# EasyEDA Pro project Drone system.epro

# Schematic Schematic1_1
Board Name: Board1; Create Date: 2025-09-21; Page Name: P1; Project Name: Gy10_201; Schematic Name: Schematic1_1; Update Date: 2025-09-21
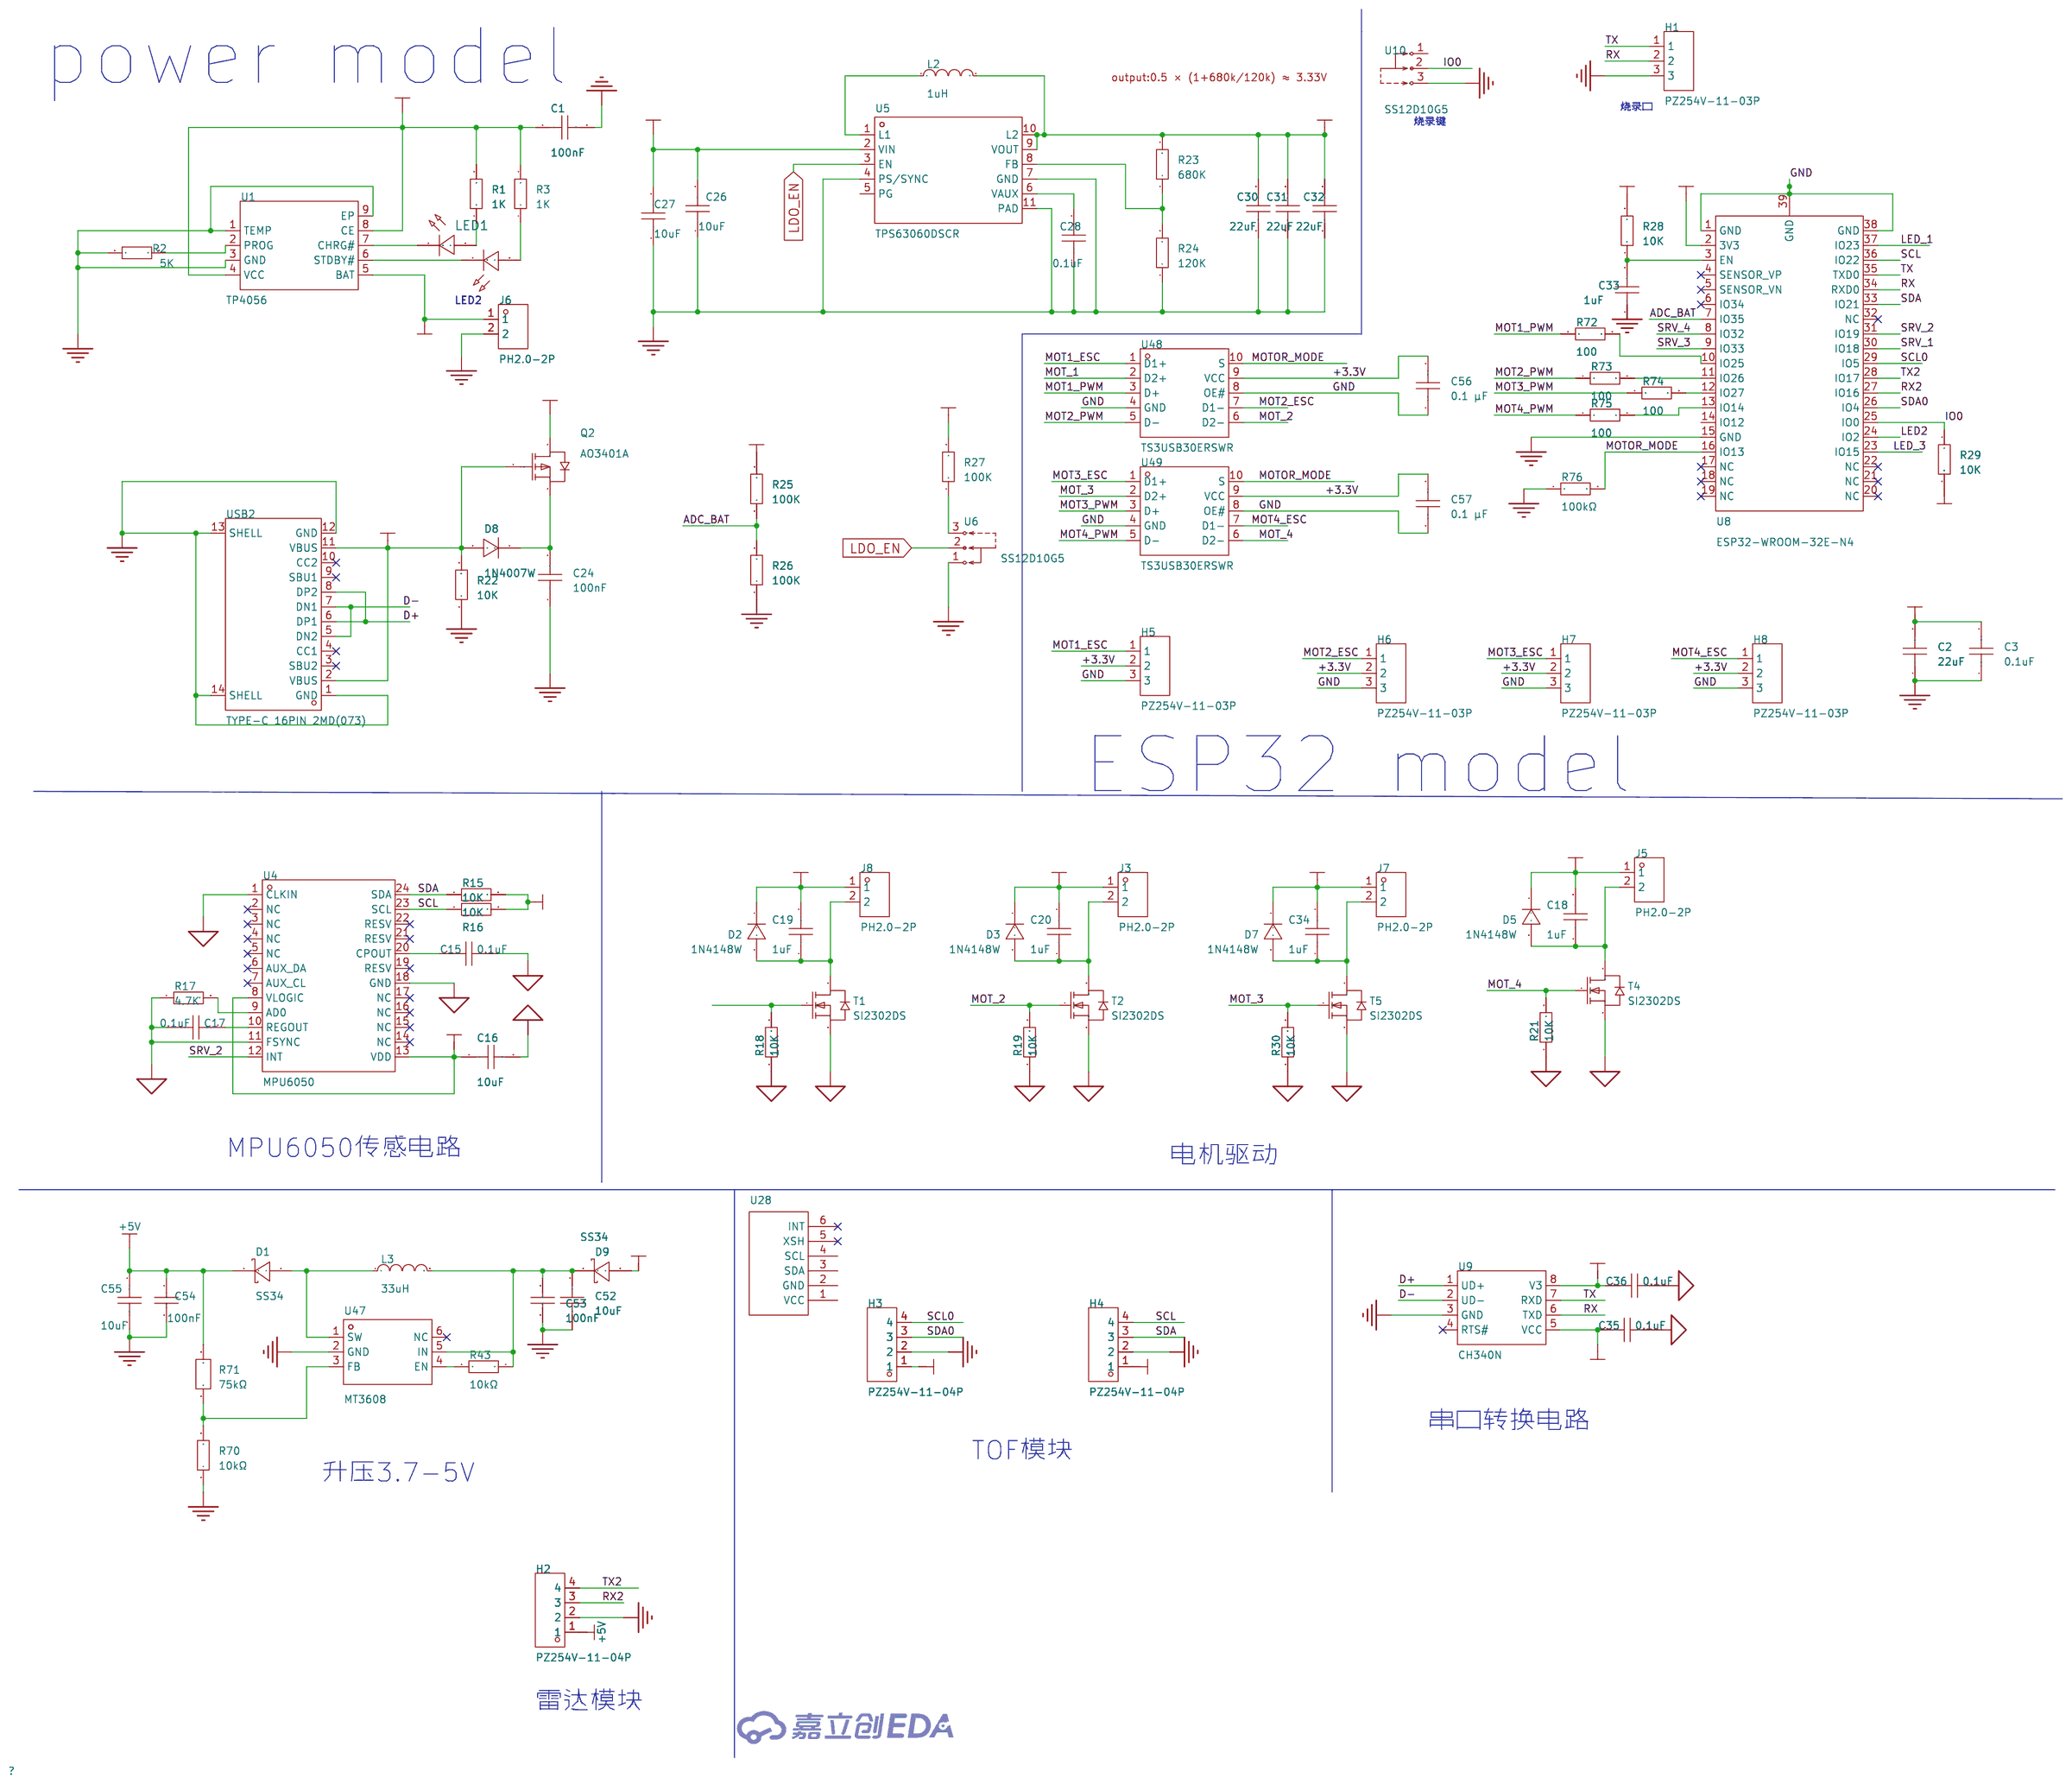
[diagram p0: schematic sheet]

## Parts
C1  100nF  [C0603]
C2  22uF  [C0603]
C3  0.1uF  [C0603]
C15  0.1uF  [C0603]
C16  10uF  [C0603]
C17  0.1uF  [C0603]
C18  1uF  [C0603]
C19  1uF  [C0603]
C20  1uF  [C0603]
C24  100nF  [C0603]
C26  10uF  [C0603]
C27  10uF  [C0603]
C28  0.1uF  [C0603]
C30  22uF  [C0603]
C31  22uF  [C0603]
C32  22uF  [C0603]
C33  1uF  [C0603]
C34  1uF  [C0603]
C35  0.1uF  [C0603]
C36  0.1uF  [C0603]
C52  10uF  [C0603]
C53  100nF  [C0603]
C54  100nF  [C0603]
C55  10uF  [C0603]
C56  0.1 µF  [C0402]
C57  0.1 µF  [C0402]
D1  SS34  [SMA_L4.3-W2.6-LS5.2-RD]
D2  1N4148W  [SOD-123F_L2.7-W1.6-LS3.8-RD]
D3  1N4148W  [SOD-123F_L2.7-W1.6-LS3.8-RD]
D5  1N4148W  [SOD-123F_L2.7-W1.6-LS3.8-RD]
D7  1N4148W  [SOD-123F_L2.7-W1.6-LS3.8-RD]
D8  1N4007W  [SOD-123FL_L2.7-W1.8-LS3.8-RD]
D9  SS34  [SMA_L4.3-W2.6-LS5.2-RD]
H1  PZ254V-11-03P  [HDR-TH_3P-P2.54-V-M]
H2  PZ254V-11-04P  [HDR-TH_4P-P2.54-V-M]
H3  PZ254V-11-04P  [HDR-TH_4P-P2.54-V-M]
H4  PZ254V-11-04P  [HDR-TH_4P-P2.54-V-M]
H5  PZ254V-11-03P  [HDR-TH_3P-P2.54-V-M]
H6  PZ254V-11-03P  [HDR-TH_3P-P2.54-V-M]
H7  PZ254V-11-03P  [HDR-TH_3P-P2.54-V-M]
H8  PZ254V-11-03P  [HDR-TH_3P-P2.54-V-M]
J3  PH2.0-2P  [CONN-TH_2P-P2.00_BOSSIE_BX-PH2.0-2PZZ]
J5  PH2.0-2P  [CONN-TH_2P-P2.00_BOSSIE_BX-PH2.0-2PZZ]
J6  PH2.0-2P  [CONN-TH_2P-P2.00_BOSSIE_BX-PH2.0-2PZZ]
J7  PH2.0-2P  [CONN-TH_2P-P2.00_BOSSIE_BX-PH2.0-2PZZ]
J8  PH2.0-2P  [CONN-TH_2P-P2.00_BOSSIE_BX-PH2.0-2PZZ]
L2  1uH  [IND-SMD_L4.4-W4.2]
L3  33uH  [IND-SMD_L7.0-W6.6_FXL0630]
LED1  -  [LED_0603]
LED2  -  [LED_0603]
Q2  AO3401A  [SOT-23_L2.9-W1.3-P1.90-LS2.4-BR]
R1  1K  [R0603]
R2  5K  [R0603]
R3  1K  [R0603]
R15  10K  [R0603]
R16  10K  [R0603]
R17  4.7K  [R0603]
R18  10K  [R0603]
R19  10K  [R0603]
R21  10K  [R0603]
R22  10K  [R0603]
R23  680K  [R0603]
R24  120K  [R0603]
R25  100K  [R0603]
R26  100K  [R0603]
R27  100K  [R0603]
R28  10K  [R0603]
R29  10K  [R0603]
R30  10K  [R0603]
R43  10kΩ  [R0603]
R70  10kΩ  [R0603]
R71  75kΩ  [R0603]
R72  100  [R0603]
R73  100  [R0603]
R74  100  [R0603]
R75  100  [R0603]
R76  100kΩ  [R0402]
T1  SI2302DS  [SOT-23-3_L2.9-W1.3-P1.90-LS2.4-BR]
T2  SI2302DS  [SOT-23-3_L2.9-W1.3-P1.90-LS2.4-BR]
T4  SI2302DS  [SOT-23-3_L2.9-W1.3-P1.90-LS2.4-BR]
T5  SI2302DS  [SOT-23-3_L2.9-W1.3-P1.90-LS2.4-BR]
U1  TP4056  [ESOP-8_L4.9-W3.9-P1.27-LS6.0-BL-EP]
U4  MPU6050  [QFN-24_L4.0-W4.0-P0.50-BL]
U5  TPS63060DSCR  [WSON-10_L3.0-W3.0-P0.50-BL-EP-A]
U6  SS12D10G5  [SW-TH_SHOU-HAN_SS12D10G4]
U8  ESP32-WROOM-32E-N4  [WIFI-SMD_ESP32-WROOM-32E]
U9  CH340N  [SOP-8_L4.9-W3.9-P1.27-LS6.0-BL]
U10  SS12D10G5  [SW-TH_SHOU-HAN_SS12D10G4]
U28  -  [VL53-L0X]  (no BOM)
U47  MT3608  [SOT-23-6_L2.9-W1.6-P0.95-LS2.8-BL]
U48  TS3USB30ERSWR  [UQFN-10_L1.8-W1.4-P0.40-TL]
U49  TS3USB30ERSWR  [UQFN-10_L1.8-W1.4-P0.40-TL]
USB2  TYPE-C 16PIN 2MD(073)  [USB-C-SMD_TYPE-C-6PIN-2MD-073]

## Library data of the parts
C1-C3 C15-C20 C24 C26-C28 C30-C36 = CAP_0603: Supplier Footprint: 0603
C52 C55 = CL10A106MA8NRNC: 容值:10uF;精度:±20%;额定电压:25V;材质(温度系数):X5R;; LCSC Part Name: 10uF ±20% 25V; Supplier Part: C96446; Manufacturer: SAMSUNG(三星); Supplier Footprint: 0603; JLCPCB Part Class: 基础库; Datasheet: https://atta.szlcsc.com/upload/public/pdf/source/20160218/1457707763339.pdf; Supplier: LCSC; Tolerance: ±20%; Voltage Rated: 25V; Temperature Coefficient: X5R
C53 C54 = 0603B104K500NT: 容值:100nF;精度:±10%;额定电压:50V;材质(温度系数):X7R;; LCSC Part Name: 100nF ±10% 50V; Supplier Part: C30926; Manufacturer: FH(风华); Supplier Footprint: 0603; JLCPCB Part Class: 扩展库; Datasheet: https://atta.szlcsc.com/upload/public/pdf/source/20200305/C486355_26A10D38EF8C2A5C37091D0039909270.pdf; Supplier: LCSC; Tolerance: ±10%; Voltage Rated: 50V; Temperature Coefficient: X7R
C56 C57 = GJM1555C1H100FB01D: 容值:10pF;精度:±1%;额定电压:50V;温度系数:C0G;; LCSC Part Name: 10pF ±1% 50V; Supplier Part: C782046; Manufacturer: muRata(村田); Supplier Footprint: 0402; JLCPCB Part Class: 扩展库; Datasheet: https://item.szlcsc.com/datasheet/GJM1555C1H100FB01D/835268.html; Supplier: LCSC; Tolerance: ±1%; Voltage Rating: 50V; Temperature Coefficient: C0G
D1 D9 = SS34_C8678: 二极管配置:独立式;正向压降(Vf):550mV@3A;直流反向耐压(Vr):40V;平均整流电流(Io):3A;; LCSC Part Name: 电压:40V 电流:3A; Supplier Part: C8678; Manufacturer: MDD; Supplier Footprint: SMA(DO-214AC); JLCPCB Part Class: 基础库; Datasheet: https://atta.szlcsc.com/upload/public/pdf/source/20230314/A80AE34493C69B89E2F4B1712F433538.pdf; Supplier: LCSC; Diode Configuration: 独立式; Forward Voltage (Vf@If): 550mV@3A; Reverse Voltage (Vr): 40V; Average Rectified Current (Io): 3A; Reverse Leakage Current (Ir): 500uA@40V
D2 D3 D5 D7 = 1N4148W_C81598: 二极管配置:独立式;正向压降(Vf):1V@50mA;直流反向耐压(Vr):75V;整流电流:150mA;反向恢复时间(trr):4ns;; Supplier Part: C81598; Manufacturer: ST(先科); Supplier Footprint: SOD-123; JLCPCB Part Class: 基础库; Datasheet: https://atta.szlcsc.com/upload/public/pdf/source/20161024/1477288446905.pdf; Supplier: LCSC; Diode Configuration: 独立式; Forward Voltage (Vf@If): 1V@50mA; Reverse Voltage (Vr): 75V; Rectified Current: 150mA; Reverse Leakage Current (Ir): 1uA@75V; Reverse Recovery Time (trr): 4ns
D8 = 1N4007W_C18199088: 二极管配置:独立式;正向压降(Vf):1V@1.0A;直流反向耐压(Vr):1kV;整流电流:1A;; Supplier Part: C18199088; Manufacturer: R+O(宏嘉诚); Supplier Footprint: SOD-123FL; JLCPCB Part Class: 扩展库; Datasheet: https://item.szlcsc.com/datasheet/1N4007W/19354320.html; Supplier: LCSC; Diode Configuration: 独立式; Voltage - Forward(Vf@If): 1V@1.0A; Voltage - DC Reverse(Vr): 1kV; Current - Rectified: 1A; Reverse Leakage Current (Ir): 2uA@1000V; Non-Repetitive Peak Forward Surge Current: 30A; Operating Junction Temperature Range: -55℃~+150℃
H1 H5-H8 = PZ254V-11-03P: 插针结构:1x3P;间距:2.54mm;行距:-;圆针/方针:方针;安装方式:直插;排数:单排;总PIN位数:3P;额定电流:3A;额定电压:250V;配合针长度:6mm;塑高:2.5mm;端接针长度:3mm;工作温度:-40℃~+105℃;颜色:黑色;; LCSC Part Name: 1x3P 间距:2.54mm 方针 直插; Supplier Part: C2937625; Manufacturer: XFCN(兴飞); Supplier Footprint: 插件,P=2.54mm; JLCPCB Part Class: 扩展库; Datasheet: https://item.szlcsc.com/datasheet/PZ254V-11-03P/3293280.html; Supplier: LCSC; Pin Structure: 1x3P; Pitch: 2.54mm; Circluar Pins/Square Pins: 方针; Mounting Type: 直插; Number of Rows: 单排; Number of Pins: 3P; Current Rating: 3A; Voltage Rating (Max): 250V; Length of Mating Pin: 6mm; Insulation Height: 2.5mm; Length of End Connection Pin: 3mm; Operating Temperature: -40℃~+105℃; Color: 黑色
H2-H4 = PZ254V-11-04P: 插针结构:1x4P;间距:2.54mm;行距:-;圆针/方针:方针;安装方式:直插;排数:单排;总PIN位数:4P;额定电流:3A;额定电压:250V;配合针长度:6mm;塑高:2.5mm;端接针长度:3mm;触头材质:-;工作温度:-40℃~+105℃;颜色:黑色;; LCSC Part Name: 1x4P 间距:2.54mm 方针 直插; Supplier Part: C2691448; Manufacturer: XFCN(兴飞); Supplier Footprint: 插件,P=2.54mm; JLCPCB Part Class: 扩展库; Datasheet: https://item.szlcsc.com/datasheet/PZ254V-11-04P/2801085.html; Supplier: LCSC; Pin Structure: 1x4P; Pitch: 2.54mm; Circluar Pins/Square Pins: 方针; Mounting Type: 直插; Number of Rows: 单排; Number of Pins: 4P; Current Rating: 3A; Voltage Rating (Max): 250V; Length of Mating Pin: 6mm; Insulation Height: 2.5mm; Length of End Connection Pin: 3mm; Operating Temperature: -40℃~+105℃; Color: 黑色
J3 J5-J8 = PH2.0-2P: Supplier Part: C9900095162; JLCPCB Part Class: 扩展库; Supplier: LCSC
L2 = FXL0420-1R0-M: 电感值:1uH;精度:±20%;额定电流:6A;饱和电流(Isat):7A;类型:一体成型电感;; LCSC Part Name: 1uH ±20% 7A; Supplier Part: C167203; Manufacturer: cjiang(长江微电); Supplier Footprint: SMD,4.2x4.4mm; JLCPCB Part Class: 扩展库; Datasheet: https://atta.szlcsc.com/upload/public/pdf/source/20240426/3189EA8206330E2108542F9E34E540E7.pdf; Supplier: LCSC; Tolerance: ±20%; Rated Current: 6A; Saturation Current (Isat): 7A; DC Resistance (DCR): 27mΩ; Type: 一体成型电感
L3 = FXL0630-330-M: 电感值:33uH;精度:±20%;额定电流:2A;饱和电流(Isat):2.5A;类型:一体成型电感;; LCSC Part Name: 33uH ±20% 2.5A; Supplier Part: C177245; Manufacturer: cjiang(长江微电); Supplier Footprint: SMD,6.6x7mm; JLCPCB Part Class: 扩展库; Datasheet: https://atta.szlcsc.com/upload/public/pdf/source/20230516/3A080F5AF8C87BB81C3BA86E5F60E51A.pdf; Supplier: LCSC; Tolerance: ±20%; Rated Current: 2A; Saturation Current (Isat): 2.5A; DC Resistance (DCR): 310mΩ; Type: 一体成型电感
LED1 = LED_0603-R: Supplier Footprint: 0603
LED2 = LED_0603-G: Supplier Footprint: 0603
Q2 = AO3401A_C15127: 类型:1个P沟道;漏源电压(Vdss):30V;连续漏极电流(Id):4A;导通电阻(RDS(on)@Vgs,Id):44mΩ@10V,4.3A;功率(Pd):1.4W;阈值电压(Vgs(th)@Id):1.3V@250uA;; LCSC Part Name: 1个P沟道 耐压:30V 电流:4A; Supplier Part: C15127; Manufacturer: AOS; Supplier Footprint: SOT-23; JLCPCB Part Class: 基础库; Datasheet: https://atta.szlcsc.com/upload/public/pdf/source/20160507/1462613609053.pdf; Supplier: LCSC; Type: 1个P沟道; Drain Source Voltage (Vdss): 30V; Continuous Drain Current (Id): 4A; Drain Source On Resistance (RDS(on)@Vgs,Id): 44mΩ@10V,4.3A; Power Dissipation (Pd): 1.4W; Gate Threshold Voltage (Vgs(th)@Id): 1.3V@250uA; Total Gate Charge (Qg@Vgs): 12.2nC@4.5V; Input Capacitance (Ciss@Vds): 1.2nF@15V; Operating Temperature: -55℃~+150℃@(Tj)
R1-R3 R15-R19 R21-R30 R72-R75 = Res_0603: Supplier Footprint: 0603
R43 R70 = 0603WAF1002T5E: 电阻类型:厚膜电阻;阻值:10kΩ;精度:±1%;功率:100mW;最大工作电压:75V;温度系数:±100ppm/℃;; LCSC Part Name: 厚膜电阻 10kΩ ±1% 100mW; Supplier Part: C25804; Manufacturer: UNI-ROYAL(厚声); Supplier Footprint: 0603; JLCPCB Part Class: 基础库; Datasheet: https://atta.szlcsc.com/upload/public/pdf/source/20200306/C422600_1E6D84923E4A46A82E41ADD87F860B5C.pdf; Supplier: LCSC; Type: 厚膜电阻; Tolerance: ±1%; Power(Watts): 100mW; Overload Voltage (Max): 75V; Temperature Coefficient: ±100ppm/℃; Operating Temperature Range: -55℃~+155℃
R71 = FRC0603F7502TS: 电阻类型:厚膜电阻;阻值:75kΩ;精度:±1%;功率:100mW;工作电压:75V;温度系数:±100ppm/℃;; LCSC Part Name: 75kΩ ±1% 100mW 厚膜电阻; Supplier Part: C2907067; Manufacturer: FOJAN(富捷); Supplier Footprint: 0603; JLCPCB Part Class: 扩展库; Supplier: LCSC; Type: 厚膜电阻; Tolerance: ±1%; Power(Watts): 100mW; Voltage-Supply(Max): 75V; Temperature Coefficient: ±100ppm/℃; Operating Temperature: -55℃~+155℃
R76 = RC0402FR-07100KL: 电阻类型:厚膜电阻;阻值:100kΩ;精度:±1%;功率:62.5mW;工作电压:50V;温度系数:±100ppm/℃;; LCSC Part Name: 厚膜电阻 100kΩ ±1% 62.5mW; Supplier Part: C60491; Manufacturer: YAGEO(国巨); Supplier Footprint: 0402; JLCPCB Part Class: 扩展库; Datasheet: https://atta.szlcsc.com/upload/public/pdf/source/20250610/89E4D743C004A82A45145C7A2CC3A578.pdf; Supplier: LCSC; Type: 厚膜电阻; Tolerance: ±1%; Power(Watts): 62.5mW; Voltage-Supply(Max): 50V; Temperature Coefficient: ±100ppm/℃; Operating Temperature: -55℃~+155℃
T1 T2 T4 T5 = SI2302DS: Supplier Part: C5310967; Manufacturer: TECH PUBLIC(台舟); Supplier Footprint: SOT-23; JLCPCB Part Class: 扩展库; Datasheet: https://atta.szlcsc.com/upload/public/pdf/source/20221212/B16F0AAB18E6EA39BF41B5B9E72B065B.pdf; Supplier: LCSC
U1 = TP4056_C725790: 工作电压:3.7V~6.5V;最大充电电流:1A;电池类型:锂离子;电池节数:1;; Supplier Part: C725790; Manufacturer: UMW(友台半导体); Supplier Footprint: ESOP-8; JLCPCB Part Class: 扩展库; Datasheet: https://item.szlcsc.com/datasheet/TP4056/772193.html; Supplier: LCSC; The Chip Type: 线性充电芯片; Voltage - Supply: 3.7V~6.5V; Charge Current - Max: 1A; Charging Saturation Voltage: 4.2V; Type of Battery: 锂离子; Number of Cells: 1; Operating Temperature: -40℃~+85℃
U4 = MPU6050: Supplier Part: C9900042518; Supplier Footprint: QFN-24_L4.0-W4.0-P0.50-BL-EP2.7; Supplier: LCSC
U5 = TPS63060DSCR: 功能类型:升降压型;输出类型:可调;工作电压:2.5V~12V;输出电压:2.5V~8V;输出电流:2A;; LCSC Part Name: 高输入电压升降压转换器; Supplier Part: C48567; Manufacturer: TI(德州仪器); Supplier Footprint: WSON-10-EP(3x3); JLCPCB Part Class: 扩展库; Datasheet: https://www.ti.com/cn/lit/gpn/tps63060; Supplier: LCSC; Function: 升降压型; Output Type: 可调; Input Voltage: 2.5V~12V; Output Voltage: 2.5V~8V; Output Current: 2A; Switching Frequency: 2.4MHz; Operating Temperature: -40℃~+85℃@(TA); Synchronous Rectification: 是; Number of Outputs: 1; Topology: 降压-升压式; Switch tube (built-in/external): 内置
U6 U10 = SS12D10G5: 电路结构:单刀双掷;安装方式:直插;额定电流(DC):2A;额定电压(DC):125V;机械寿命:3千次;; LCSC Part Name: 两档立式插件 3脚拨动开关 柄长5.0mm; Supplier Part: C7431054; Manufacturer: SHOU HAN(首韩); Supplier Footprint: 插件; JLCPCB Part Class: 扩展库; Datasheet: https://atta.szlcsc.com/upload/public/pdf/source/20231130/7A3DB6A149BF0A1DCFFE64FFC07FE434.pdf; Supplier: LCSC; Circuit: 单刀双掷; Switch Length: 12.7mm; Switch Width: 6.7mm; Mounting Style: 直插; Current Rating (DC): 2A; Voltage Rating (DC): 125V; Mechanical Life: 3千次; Operating Temperature: -25℃~+70℃
U8 = ESP32-WROOM-32E-N4: ESP32-WROOM-32E 集成 ESP32-D0WD-V3 芯片，具有高的稳定性和安全性能。; LCSC Part Name: 通用型Wi-Fi+BT+BLE MCU模组; Supplier Part: C701341; Manufacturer: ESPRESSIF(乐鑫); Supplier Footprint: SMD,18x25.5mm; JLCPCB Part Class: 扩展库; Datasheet: https://atta.szlcsc.com/upload/public/pdf/source/20241030/447B1C85FFE3FB0A37F75624F2C6635F.pdf; Supplier: LCSC
U9 = CH340N: 应用功能:USB转串口;接口协议:USB 2.0;通道数:1;数据速率:2Mbps;; LCSC Part Name: USB2.0芯片CH340; Supplier Part: C2977777; Manufacturer: WCH(南京沁恒); Supplier Footprint: SOP-8; JLCPCB Part Class: 扩展库; Datasheet: https://atta.szlcsc.com/upload/public/pdf/source/20240313/115CDE92081B1D6CB446704AD5D0F5F2.pdf; Supplier: LCSC; Applications Function: USB转串口; Protocol: USB 2.0; Number of Channels: 1; Voltage - Supply: 3.3V；5V; Data Rate: 2Mbps; Operating Temperature: -20℃~+70℃
U28 = VL53-L0X: 直插型
U47 = MT3608: 功能类型:升压型;输入电压:2V~24V;输出电压:28V;输出电流(最大值):-;; Supplier Part: C84817; Manufacturer: 西安航天民芯; Supplier Footprint: SOT-23-6; JLCPCB Part Class: 扩展库; Datasheet: https://atta.szlcsc.com/upload/public/pdf/source/20161110/1478743351706.pdf; Supplier: LCSC; Function: 升压型; Input Voltage: 2V~24V; Output Voltage: 28V; Switching Frequency: 1.2MHz; Number of Outputs: 1; Topology: 升压式; Switch tube (built-in/external): 内置
U48 U49 = TS3USB30ERSWR: 开关电路:双刀双掷(DPDT);通道数:1;导通电阻(Ron):10Ω;; Supplier Part: C73880; Manufacturer: TI(德州仪器); Supplier Footprint: UQFN-10(1.4x1.8); JLCPCB Part Class: 扩展库; Datasheet: https://www.ti.com/cn/lit/gpn/ts3usb30e; Supplier: LCSC; Switch Circuit: 双刀双掷(DPDT); Number of Channels: 1; Voltage - Supply: 3V~4.3V; Ron: 10Ω; Operating Temperature: -40℃~+85℃
USB2 = TYPE-C 16PIN 2MD(073): 连接器类型:Type-C;协议标准:USB 3.1;公母:母;安装方式:卧贴;触点数量:16P;端口数量:1;额定电流 - 电源:3A;工作温度:-25℃~+85℃;; LCSC Part Name: Type-C 母 卧贴; Supplier Part: C2765186; Manufacturer: SHOU HAN(首韩); Supplier Footprint: SMD; JLCPCB Part Class: 扩展库; Datasheet: https://item.szlcsc.com/datasheet/TYPE-C%252016PIN%25202MD(073)/2901843.html; Supplier: LCSC; Connector Type: Type-C; Protocol Standard: USB 3.1; Gender: 母; Mounting Type: 卧贴; Number of Contacts: 16P; Number of Ports: 1; Current Rating-Power: 3A; Voltage Rating: 5V; Connect-Disconnect Life: 5千次; Detection color: 黑色; Operating Temperature: -25℃~+85℃

## Nets
+3.3V: C2.2 C3.2 C16.1 C30.2 C31.2 C32.2 C35.1 C36.1 C56.2 C57.2 H3.1 H4.1 H5.2 H6.2 H7.2 H8.2 L2.2 R15.2 R16.2 R23.2 R28.2 R29.2 U4.8(VLOGIC) U4.13(VDD) U5.9(VOUT) U5.10(L2) U8.2(3V3) U9.5(VCC) U9.8(V3) U48.9(VCC) U49.9(VCC)
+5V: C54.2 C55.2 D1.1(K) H2.1 R71.2
GND: C1.2 C2.1 C3.1 C15.2 C16.2 C17.1 C24.1 C26.1 C27.1 C28.1 C30.1 C31.1 C32.1 C33.1 C35.2 C36.2 C52.1 C53.1 C54.1 C55.1 C56.1 C57.1 H1.3 H2.2 H3.2 H4.2 H5.3 H6.3 H7.3 H8.3 J6.2 R2.1 R17.1 R18.1 R19.1 R21.1 R22.1 R24.1 R26.1 R30.1 R70.1 R76.1 T1.2(S) T2.2(S) T4.2(S) T5.2(S) U1.1(TEMP) U1.3(GND) U1.9(EP) U4.1(CLKIN) U4.11(FSYNC) U4.18(GND) U5.4(PS/SYNC) U5.7(GND) U5.11(PAD) U6.1 U8.1(GND) U8.15(GND) U8.38(GND) U8.39(GND) U9.3(GND) U10.3 U47.2(GND) U48.4(GND) U48.8(OE#) U49.4(GND) U49.8(OE#) USB2.1(GND) USB2.12(GND) USB2.13(SHELL) USB2.14(SHELL)
VBUS: C1.1 D8.2(A) Q2.1(G) R1.2 R3.2 R22.2 U1.4(VCC) U1.8(CE) USB2.2(VBUS) USB2.11(VBUS)
+BATT: C18.2 C19.2 C20.2 C26.2 C27.2 C34.2 D2.1(K) D3.1(K) D5.1(K) D7.1(K) D9.2(A) J3.1 J5.1 J6.1 J7.1 J8.1 Q2.3(D) R25.2 R27.2 U1.5(BAT) U5.2(VIN)
ADC_BAT: R25.1 R26.2 U8.7(IO35)
D+: U9.1(UD+) USB2.6(DP1) USB2.8(DP2)
D-: U9.2(UD-) USB2.5(DN2) USB2.7(DN1)
IO0: R29.1 U8.25(IO0) U10.2
LDO_EN: U5.3(EN) U6.2
LED2: U8.24(IO2)
LED_1: U8.37(IO23)
LED_3: U8.23(IO15)
MOT1_ESC: H5.1 U48.1(D1+)
MOT1_PWM: R72.1 U48.3(D+)
MOT2_ESC: H6.1 U48.7(D1-)
MOT2_PWM: R73.1 U48.5(D-)
MOT3_ESC: H7.1 U49.1(D1+)
MOT3_PWM: R74.1 U49.3(D+)
MOT4_ESC: H8.1 U49.7(D1-)
MOT4_PWM: R75.1 U49.5(D-)
MOT_1: R18.2 T1.1(G) U48.2(D2+)
MOT_2: R19.2 T2.1(G) U48.6(D2-)
MOT_3: R30.2 T5.1(G) U49.2(D2+)
MOT_4: R21.2 T4.1(G) U49.6(D2-)
MOTOR_MODE: R76.2 U8.16(IO13) U48.10(S) U49.10(S)
RX: H1.2 U8.34(RXD0) U9.6(TXD)
RX2: H2.3 U8.27(IO16)
SCL: H4.4 R16.1 U4.23(SCL) U8.36(IO22)
SCL0: H3.4 U8.29(IO5)
SDA: H4.3 R15.1 U4.24(SDA) U8.33(IO21)
SDA0: H3.3 U8.26(IO4)
SRV_1: U8.30(IO18)
SRV_2: U4.12(INT) U8.31(IO19)
SRV_3: U8.9(IO33)
SRV_4: U8.8(IO32)
TX: H1.1 U8.35(TXD0) U9.7(RXD)
TX2: H2.4 U8.28(IO17)
$1N491: R2.2 U1.2(PROG)
$1N492: LED1.1(C) U1.7(CHRG#)
$1N493: LED2.1(C) U1.6(STDBY#)
$1N494: LED2.2(A) R3.1
$1N495: LED1.2(A) R1.1
$1N867: L2.1 U5.1(L1)
$1N870: C28.2 U5.6(VAUX)
$1N872: R23.1 R24.2 U5.8(FB)
$1N1145: C24.2 D8.1(K) Q2.2(S)
$1N1344: R27.1 U6.3
$1N5121: C15.1 U4.20(CPOUT)
$1N5126: R17.2 U4.9(AD0)
$1N5127: C17.2 U4.10(REGOUT)
$1N5140: C19.1 D2.2(A) J8.2 T1.3(D)
$1N5142: C20.1 D3.2(A) J3.2 T2.3(D)
$1N5148: C18.1 D5.2(A) J5.2 T4.3(D)
$1N7597: C33.2 R28.1 U8.3(EN)
$1N14604: C34.1 D7.2(A) J7.2 T5.3(D)
$1N20359: R70.2 R71.1 U47.3(FB)
$1N20363: D1.2(A) L3.1 U47.1(SW)
$1N20365: C52.2 C53.2 D9.1(K) L3.2 R43.1 U47.5(IN)
$1N20367: R43.2 U47.4(EN)
$1N24117: R72.2 U8.10(IO25)
$1N24167: R73.2 U8.11(IO26)
$1N24195: R74.2 U8.12(IO27)
$1N24223: R75.2 U8.13(IO14)

Not connected (* = marked no-connect by the designer): U4 2(NC)* 3(NC)* 4(NC)* 5(NC)* 6(AUX_DA)* 7(AUX_CL)* 14(NC)* 15(NC)* 16(NC)* 17(NC)* 19(RESV)* 21(RESV)* 22(RESV)*; U5 5(PG); U8 4(SENSOR_VP)* 5(SENSOR_VN)* 6(IO34)* 14(IO12) 17(NC)* 18(NC)* 19(NC)* 20(NC)* 21(NC)* 22(NC)* 32(NC)*; U9 4(RTS#)*; U10 1; U28 1(VCC) 2(GND) 3(SDA) 4(SCL) 5(XSH)* 6(INT)*; U47 6(NC)*; USB2 3(SBU2)* 4(CC1)* 9(SBU1)* 10(CC2)*

## Notes on the sheet
- output:0.5 × (1+680k/120k) ≈ 3.33V
- power model
- 烧录口
- 烧录键
- ESP32 model
- MPU6050传感电路
- 电机驱动
- 串口转换电路
- TOF模块
- 升压3.7-5V
- 雷达模块

# Board PCB1_1
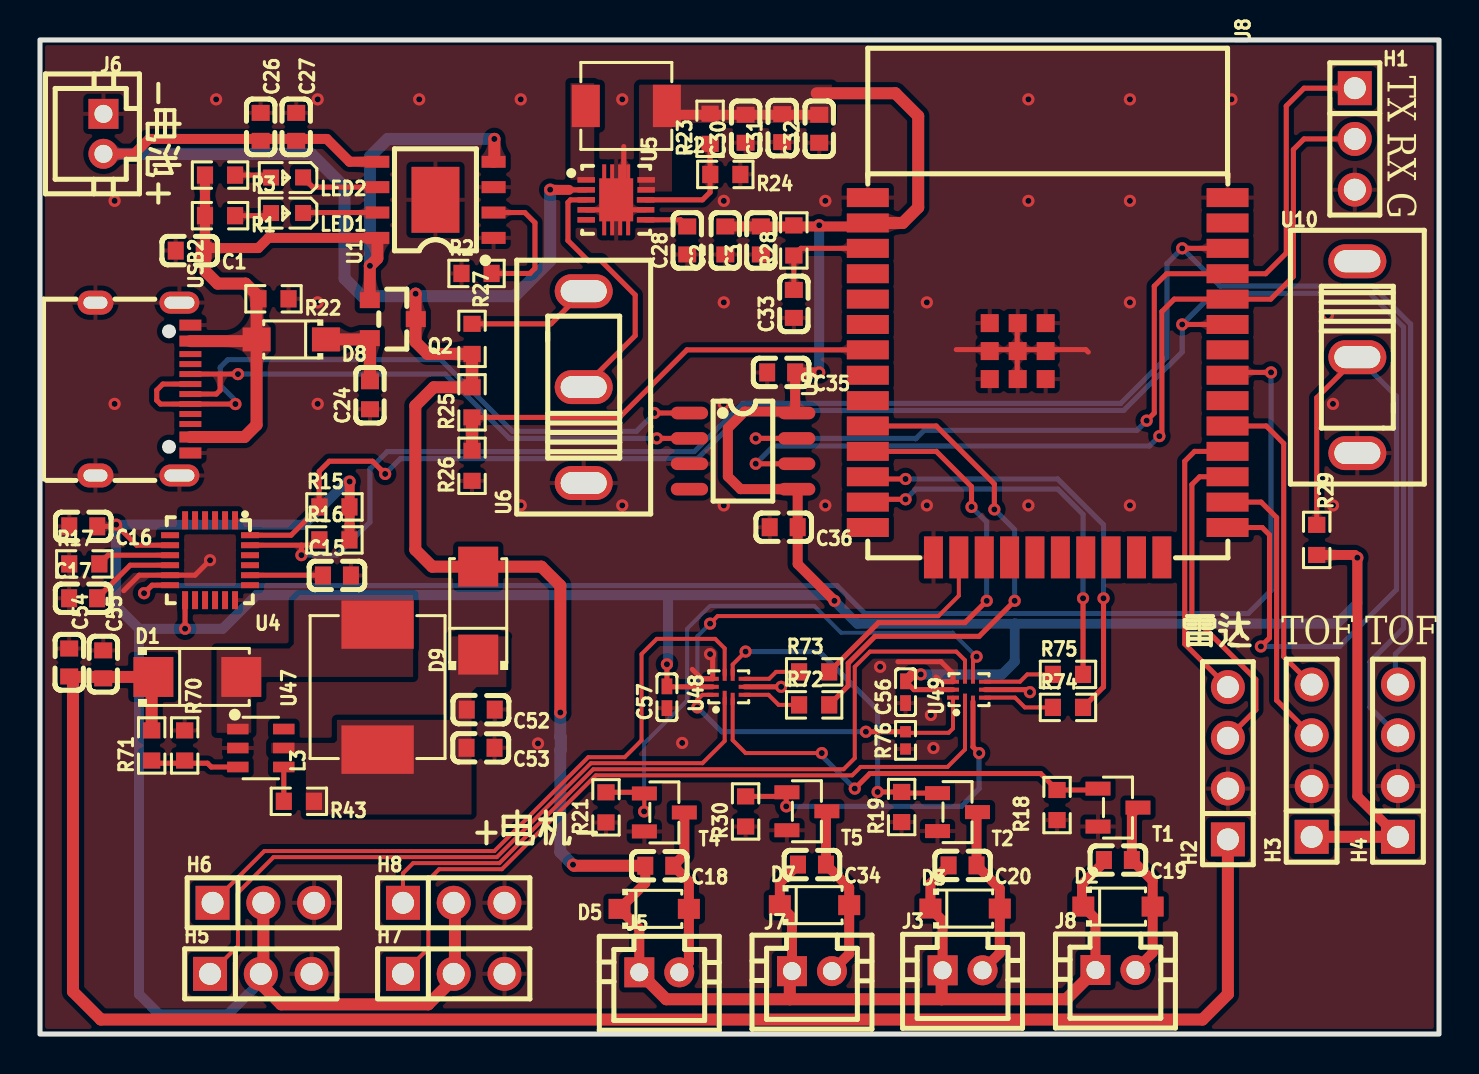
[diagram p1: board, top side]
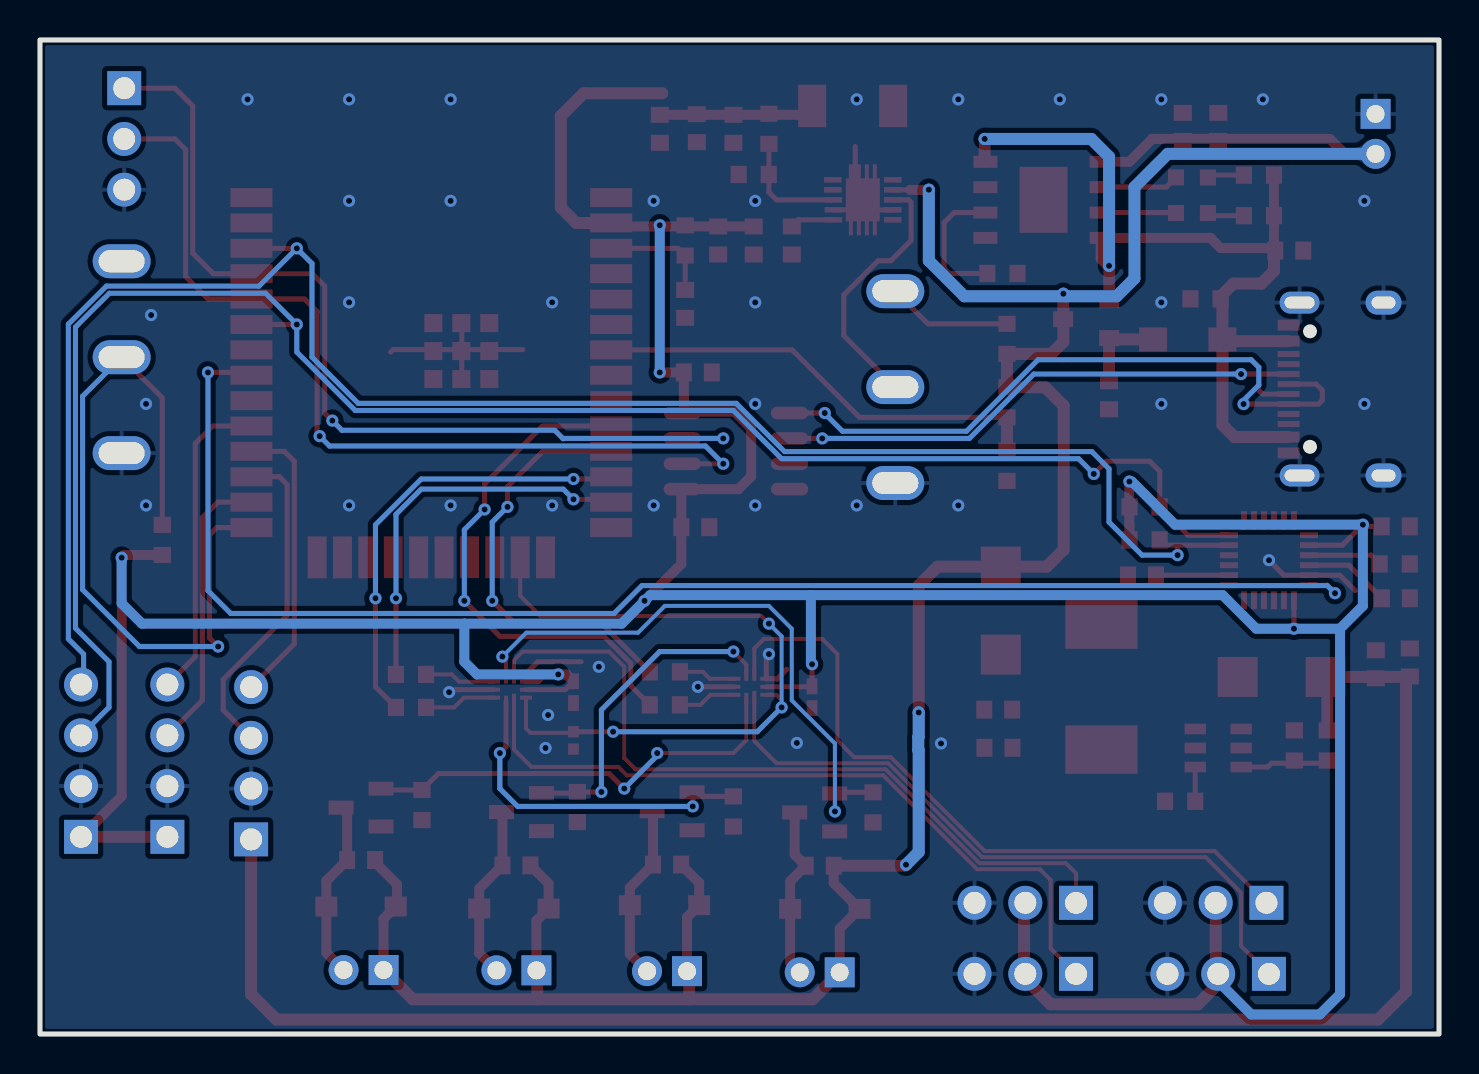
[diagram p2: board, bottom side, seen from below]

Outline 70 x 49.75 mm; copper layers: Top Layer, Bottom Layer. Coordinates in mm from the lower left corner of the outline.
Outline path: rectangle 0,49.75 70,0
Stack: Top Layer 0.035mm / Dielectric1 1.51mm FR4 er 4.5 / Bottom Layer 0.035mm

## Design rules (mm)
template: 自定义配置
spacing copperThickness1oz (default): track to track 0.102, other pairs 0.152 to 0.3
spacing copperThickness2oz: track to track 0.203, other pairs 0.152 to 0.3
spacing safeClearance1: track to track 0.05, other pairs 0.152 to 0.3
track width copperThickness1oz (default): min 0.127, default 0.254, max 2.54
track width copperThickness2oz: min 0.203, default 0.254, max 2.54
differential pair differentialPair (default): width min 0.127, default 0.254, max 2.54; gap min 0.152, default 0.152
via viaSize (default): diameter min 0.5, default 0.61, max 10; hole min 0.3, default 0.305, max 6.3

## Placement (name value [footprint] x y rotation side)
C1  100nF  [C0603]  7.49 39.21 180 top
C2  22uF  [C0603]  34.29 39.71 90 top
C3  0.1uF  [C0603]  36.07 39.71 90 top
C15  0.1uF  [C0603]  14.86 22.95 0 top
C16  10uF  [C0603]  2.17 25.41 180 top
C17  0.1uF  [C0603]  2.16 21.81 0 top
C18  1uF  [C0603]  30.99 8.42 180 top
C19  1uF  [C0603]  53.93 8.71 180 top
C20  1uF  [C0603]  46.16 8.44 180 top
C24  100nF  [C0603]  16.51 31.97 90 top
C26  10uF  [C0603]  11.04 45.4 270 top
C27  10uF  [C0603]  12.82 45.4 270 top
C28  0.1uF  [C0603]  32.39 39.71 90 top
C30  22uF  [C0603]  35.31 45.3 90 top
C31  22uF  [C0603]  37.14 45.34 90 top
C32  22uF  [C0603]  38.99 45.3 90 top
C33  1uF  [C0603]  37.72 36.54 90 top
C34  1uF  [C0603]  38.63 8.48 180 top
C35  0.1uF  [C0603]  37.08 33.11 180 top
C36  0.1uF  [C0603]  37.21 25.36 180 top
C52  10uF  [C0603]  22.05 16.24 180 top
C53  100nF  [C0603]  22.04 14.33 180 top
C54  100nF  [C0603]  1.46 18.59 270 top
C55  10uF  [C0603]  3.16 18.5 270 top
C56  0.1 µF  [C0402]  43.31 17.11 90 top
C57  0.1 µF  [C0402]  31.37 16.85 90 top
D1  SS34  [SMA_L4.3-W2.6-LS5.2-RD]  7.87 17.87 0 top
D2  1N4148W  [SOD-123F_L2.7-W1.6-LS3.8-RD]  53.94 6.38 0 top
D3  1N4148W  [SOD-123F_L2.7-W1.6-LS3.8-RD]  46.29 6.28 0 top
D5  1N4148W  [SOD-123F_L2.7-W1.6-LS3.8-RD]  30.73 6.26 0 top
D7  1N4148W  [SOD-123F_L2.7-W1.6-LS3.8-RD]  38.75 6.45 0 top
D8  1N4007W  [SOD-123FL_L2.7-W1.8-LS3.8-RD]  12.57 34.76 180 top
D9  SS34  [SMA_L4.3-W2.6-LS5.2-RD]  21.93 21.19 90 top
H1  PZ254V-11-03P  [HDR-TH_3P-P2.54-V-M]  65.79 44.79 270 top
H2  PZ254V-11-04P  [HDR-TH_4P-P2.54-V-M]  59.44 13.55 90 top
H3  PZ254V-11-04P  [HDR-TH_4P-P2.54-V-M]  63.63 13.68 90 top
H4  PZ254V-11-04P  [HDR-TH_4P-P2.54-V-M]  67.95 13.68 90 top
H5  PZ254V-11-03P  [HDR-TH_3P-P2.54-V-M]  11.05 3.01 0 top
H6  PZ254V-11-03P  [HDR-TH_3P-P2.54-V-M]  11.18 6.57 0 top
H7  PZ254V-11-03P  [HDR-TH_3P-P2.54-V-M]  20.7 3.01 0 top
H8  PZ254V-11-03P  [HDR-TH_3P-P2.54-V-M]  20.7 6.57 0 top
J3  PH2.0-2P  [CONN-TH_2P-P2.00_BOSSIE_BX-PH2.0-2PZZ]  46.16 3.19 0 top
J5  PH2.0-2P  [CONN-TH_2P-P2.00_BOSSIE_BX-PH2.0-2PZZ]  30.99 3.09 0 top
J6  PH2.0-2P  [CONN-TH_2P-P2.00_BOSSIE_BX-PH2.0-2PZZ]  3.17 45.05 270 top
J7  PH2.0-2P  [CONN-TH_2P-P2.00_BOSSIE_BX-PH2.0-2PZZ]  38.63 3.15 0 top
J8  PH2.0-2P  [CONN-TH_2P-P2.00_BOSSIE_BX-PH2.0-2PZZ]  53.81 3.2 0 top
L2  1uH  [IND-SMD_L4.4-W4.2]  29.34 46.44 180 top
L3  33uH  [IND-SMD_L7.0-W6.6_FXL0630]  16.89 17.36 90 top
LED1  -  [LED_0603]  12.31 41.08 180 top
LED2  -  [LED_0603]  12.31 42.86 180 top
Q2  AO3401A  [SOT-23_L2.9-W1.3-P1.90-LS2.4-BR]  17.65 35.78 180 top
R1  1K  [R0603]  9.01 40.95 180 top
R2  5K  [R0603]  21.84 38.06 0 top
R3  1K  [R0603]  9.01 42.98 180 top
R15  10K  [R0603]  14.73 26.38 0 top
R16  10K  [R0603]  14.73 24.73 0 top
R17  4.7K  [R0603]  2.22 23.53 0 top
R18  10K  [R0603]  50.89 11.46 90 top
R19  10K  [R0603]  43.11 11.36 90 top
R21  10K  [R0603]  28.32 11.34 90 top
R22  10K  [R0603]  11.68 36.79 180 top
R23  680K  [R0603]  33.53 45.3 90 top
R24  120K  [R0603]  34.29 43.02 180 top
R25  100K  [R0603]  21.62 31.61 90 top
R26  100K  [R0603]  21.62 28.44 90 top
R27  100K  [R0603]  21.62 34.79 270 top
R28  10K  [R0603]  37.72 39.71 90 top
R29  10K  [R0603]  63.88 24.73 270 top
R30  10K  [R0603]  35.31 11.14 90 top
R43  10kΩ  [R0603]  12.95 11.65 180 top
R70  10kΩ  [R0603]  7.24 14.44 270 top
R71  75kΩ  [R0603]  5.59 14.44 90 top
R72  100  [R0603]  38.73 16.47 0 top
R73  100  [R0603]  38.73 18.12 0 top
R74  100  [R0603]  51.43 16.35 0 top
R75  100  [R0603]  51.43 18 0 top
R76  100kΩ  [R0402]  43.31 14.69 90 top
T1  SI2302DS  [SOT-23-3_L2.9-W1.3-P1.90-LS2.4-BR]  53.94 11.33 180 top
T2  SI2302DS  [SOT-23-3_L2.9-W1.3-P1.90-LS2.4-BR]  45.91 11.11 180 top
T4  SI2302DS  [SOT-23-3_L2.9-W1.3-P1.90-LS2.4-BR]  31.24 11.09 180 top
T5  SI2302DS  [SOT-23-3_L2.9-W1.3-P1.90-LS2.4-BR]  38.37 11.15 180 top
U1  TP4056  [ESOP-8_L4.9-W3.9-P1.27-LS6.0-BL-EP]  19.79 41.75 90 top
U4  MPU6050  [QFN-24_L4.0-W4.0-P0.50-BL]  8.51 23.71 180 top
U5  TPS63060DSCR  [WSON-10_L3.0-W3.0-P0.50-BL-EP-A]  28.83 41.75 270 top
U6  SS12D10G5  [SW-TH_SHOU-HAN_SS12D10G4]  27.2 32.38 90 top
U8  ESP32-WROOM-32E-N4  [WIFI-SMD_ESP32-WROOM-32E]  50.42 32.86 270 top
U9  CH340N  [SOP-8_L4.9-W3.9-P1.27-LS6.0-BL]  35.18 29.17 270 top
U10  SS12D10G5  [SW-TH_SHOU-HAN_SS12D10G4]  65.91 33.87 270 top
U47  MT3608  [SOT-23-6_L2.9-W1.6-P0.95-LS2.8-BL]  11.05 14.31 270 top
U48  TS3USB30ERSWR  [UQFN-10_L1.8-W1.4-P0.40-TL]  34.46 17.38 90 top
U49  TS3USB30ERSWR  [UQFN-10_L1.8-W1.4-P0.40-TL]  46.48 17.23 90 top
USB2  TYPE-C 16PIN 2MD(073)  [USB-C-SMD_TYPE-C-6PIN-2MD-073]  5.15 32.28 270 top

## Footprints (pads in the part's own frame, mm; a bottom-side part is the same pattern mirrored in y, then rotated)
C0402
  rect 0.79x0.54 smd: 1(-0.545,0) 2(0.545,0)
C0603
  rect 0.8x0.9 smd: 1(-0.7,0) 2(0.7,0)
CONN-TH_2P-P2.00_BOSSIE_BX-PH2.0-2PZZ
  rect 1.5x1.5 hole 0.9: 1(-1,0)
  round 1.5 hole 0.9: 2(1,0)
ESOP-8_L4.9-W3.9-P1.27-LS6.0-BL-EP
  rect 0.6x1.2 smd: 1(-1.905,-2.909) 2(-0.635,-2.909) 3(0.635,-2.909) 4(1.905,-2.909) 5(1.905,2.909) 6(0.635,2.909) 7(-0.635,2.909) 8(-1.905,2.909)
  rect 3.3x2.4 smd: 9(0,0)
HDR-TH_3P-P2.54-V-M
  rect 1.7x1.7 hole 1.1: 1(-2.54,0)
  round 1.7 hole 1.1: 2(0,0) 3(2.54,0)
HDR-TH_4P-P2.54-V-M
  rect 1.7x1.7 hole 1.1: 1(-3.81,0)
  round 1.7 hole 1.1: 2(-1.27,0) 3(1.27,0) 4(3.81,0)
IND-SMD_L4.4-W4.2
  rect 1.4x2.12 smd: 1(2.028,0) 2(-2.028,0)
IND-SMD_L7.0-W6.6_FXL0630
  rect 2.424x3.62 smd: 1(3.128,0) 2(-3.128,0)
LED_0603
  rect 0.8x0.8 smd: 1(-0.851,-0.01) 2(0.75,-0.005)
QFN-24_L4.0-W4.0-P0.50-BL
  rect 0.3x0.9 smd: 1(-1.25,-2) 2(-0.75,-2) 3(-0.25,-2) 4(0.25,-2) 5(0.75,-2) 6(1.25,-2) 13(1.25,2) 14(0.75,2) 15(0.25,2) 16(-0.25,2) 17(-0.75,2) 18(-1.25,2)
  rect 0.9x0.3 smd: 7(2,-1.25) 8(2,-0.75) 9(2,-0.25) 10(2,0.25) 11(2,0.75) 12(2,1.25) 19(-2,1.25) 20(-2,0.75) 21(-2,0.25) 22(-2,-0.25) 23(-2,-0.75) 24(-2,-1.25)
R0402
  rect 0.566x0.54 smd: 1(-0.433,0) 2(0.433,0)
R0603
  rect 0.806x0.864 smd: 1(-0.753,0) 2(0.753,0)
SMA_L4.3-W2.6-LS5.2-RD
  rect 2x2 smd: 1(-2.2,0) 2(2.2,0)
SOD-123F_L2.7-W1.6-LS3.8-RD
  rect 1.1x1 smd: 1(-1.735,0) 2(1.735,0)
SOD-123FL_L2.7-W1.8-LS3.8-RD
  rect 1.4x1.2 smd: 1(-1.735,0) 2(1.735,0)
SOP-8_L4.9-W3.9-P1.27-LS6.0-BL
  oval 0.63x1.865 smd: 1(-1.905,-2.683) 2(-0.635,-2.683) 3(0.635,-2.683) 4(1.905,-2.683) 5(1.905,2.683) 6(0.635,2.683) 7(-0.635,2.683) 8(-1.905,2.683)
SOT-23-3_L2.9-W1.3-P1.90-LS2.4-BR
  rect 1.25x0.7 smd: 1(1,-0.95) 2(1,0.95) 3(-1,0)
SOT-23-6_L2.9-W1.6-P0.95-LS2.8-BL
  rect 0.532x1.072 smd: 1(-0.95,-1.149) 2(0,-1.149) 3(0.95,-1.149) 4(0.95,1.149) 5(0,1.149) 6(-0.95,1.149)
SOT-23_L2.9-W1.3-P1.90-LS2.4-BR
  rect 1x0.8 smd: 1(1.15,-0.95) 2(1.15,0.95) 3(-1.15,0)
SW-TH_SHOU-HAN_SS12D10G4
  oval 1.7x2.9 hole 1.1x2.3: 1(-4.8,0) 2(0,0) 3(4.8,0)
UQFN-10_L1.8-W1.4-P0.40-TL
  rect 0.7x0.2 smd: 1(-0.55,0.2)
  rect 0.6x0.2 smd: 2(-0.6,-0.2) 6(0.6,-0.2) 7(0.6,0.2)
  rect 0.2x0.6 smd: 3(-0.4,-0.8) 4(0,-0.8) 5(0.4,-0.8) 8(0.4,0.8) 9(0,0.8) 10(-0.4,0.8)
USB-C-SMD_TYPE-C-6PIN-2MD-073
  rect 0.55x1.1 smd: 1(-3.2,2.375) 2(-2.4,2.375) 11(2.4,2.375) 12(3.2,2.375)
  rect 0.3x1.1 smd: 3(-1.75,2.375) 4(-1.25,2.375) 5(-0.75,2.375) 6(-0.25,2.375) 7(0.25,2.375) 8(0.75,2.375) 9(1.25,2.375) 10(1.75,2.375)
  oval 1.1x2 hole 0.6x1.5: 13(-4.325,1.825) 14(4.325,1.825)
  oval 1.2x1.8 hole 0.6x1.2: 13(-4.325,-2.375) 14(4.325,-2.375)
WIFI-SMD_ESP32-WROOM-32E
  rect 0.95x2.1 smd: 1(-9.002,-9) 2(-7.732,-9) 3(-6.463,-9) 4(-5.192,-9) 5(-3.922,-9) 6(-2.652,-9) 7(-1.383,-9) 8(-0.113,-9) 9(1.157,-9) 10(2.428,-9) 11(3.697,-9) 12(4.968,-9) 13(6.237,-9) 14(7.508,-9) 25(7.508,9) 26(6.237,9) 27(4.968,9) 28(3.697,9) 29(2.428,9) 30(1.157,9) 31(-0.113,9) 32(-1.383,9) 33(-2.652,9) 34(-3.922,9) 35(-5.192,9) 36(-6.463,9) 37(-7.732,9) 38(-9.002,9)
  rect 2.1x0.95 smd: 15(9.002,-5.715) 16(9.002,-4.445) 17(9.002,-3.175) 18(9.002,-1.905) 19(9.002,-0.635) 20(9.002,0.635) 21(9.002,1.905) 22(9.002,3.175) 23(9.002,4.445) 24(9.002,5.715)
  rect 0.9x0.9 smd: 39(-2.721,-0.1) 39(-2.721,-1.5) 39(-2.721,-2.9) 39(-1.321,-0.1) 39(-1.321,-1.5) 39(-1.321,-2.9) 39(0.079,-0.1) 39(0.079,-1.5) 39(0.079,-2.9)
WSON-10_L3.0-W3.0-P0.50-BL-EP-A
  rect 0.28x0.876 smd: 1(-1,-1.5) 2(-0.5,-1.5) 3(0,-1.5) 4(0.5,-1.5) 5(1,-1.5) 6(1,1.474) 7(0.499,1.472) 8(-0.001,1.473) 9(-0.5,1.5) 10(-1,1.5)
  custom 3.55x1.7 smd: 11(0,0)

## Nets
As in the schematic, except:
GND: C1.2 C2.1 C3.1 C15.2 C16.2 C17.1 C24.1 C26.1 C27.1 C28.1 C30.1 C31.1 C32.1 C33.1 C35.2 C36.2 C52.1 C53.1 C54.1 C55.1 C56.1 C57.1 H1.3 H2.2 H3.2 H4.2 H5.3 H6.3 H7.3 H8.3 J6.1 R2.1 R17.1 R18.1 R19.1 R21.1 R22.1 R24.1 R26.1 R30.1 R70.1 R76.1 T1.2 T2.2 T4.2 T5.2 U1.1 U1.3 U1.9 U4.1 U4.11 U4.18 U5.4 U5.7 U5.11 U6.1 U8.1 U8.15 U8.38 U8.39 U9.3 U10.3 U47.2 U48.4 U48.8 U49.4 U49.8 USB2.1 USB2.12 USB2.13 USB2.14
+BATT: C18.2 C19.2 C20.2 C26.2 C27.2 C34.2 D2.1 D3.1 D5.1 D7.1 D9.2 J3.1 J5.1 J6.2 J7.1 J8.1 Q2.3 R25.2 R27.2 U1.5 U5.2

Pads without a net: U4 2 3 4 5 6 7 14 15 16 17 19 21 22; U5 5; U8 4 5 6 14 17 18 19 20 21 22 32; U9 4; U10 1; U47 6; USB2 3 4 9 10

## Via types
v1: diameter 0.61, hole 0.305, Top Layer to Bottom Layer, 88 vias

## Routing (per net, layer and track width the routed paths; a pad name or vN(x,y) marks a point on that pad's centre or on a via; arc(x,y) is an arc through that point)
+3.3V: length 229.3
  Top Layer w0.254: 33.66,17.38 31.39,17.38 C57.2 v1(31.37,18.5) ; C16.1 3.89,25.41 4.84,24.46 U4.8 ; U4.13 v1(7.26,20.28) ; U49.9 43.73,17.23 C56.2
  Top Layer w0.5: v1(39.75,21.68) 37.91,23.52 C36.1 37.91,27.22 U9.5 35.05,27.27 34.42,27.9 34.42,30.32 35.26,31.16 37.78,31.16 ; v1(44.07,18) 43.65,18 C56.2 ; 37.78,31.16 U9.8 ; 37.78,31.16 C35.1 v1(38.99,33.11) ; L2.2 31.81,46 38.99,46 ; H4.1 65.91,11.9 v1(65.91,23.84) 65.78,23.97 R29.2 ; R16.2 15.49,25.48 15.49,25.49 v1(15.49,27.65) ; U8.2 41.24,40.41 C3.2 C2.2
  Top Layer w0.6: H3.1 H4.1 ; 38.86,47.08 42.8,47.08 43.94,45.94 43.94,41.36 43.17,40.59 U8.2 ; 20.76,6.7 20.76,2.82 19.43,1.49 12.06,1.49 11.18,2.38 H6.2 11.05,6.69
  Bottom Layer w0.5: v1(44.07,18) 48.13,18 48.77,18.63 48.77,20.54 ; 31.43,21.96 31.43,18.56 v1(31.37,18.5) ; 31.43,21.96 10.82,21.96 9.14,20.28 v1(7.26,20.28) 4.95,20.28 ; 31.43,21.96 39.47,21.96 v1(39.75,21.68) 40.89,20.54 48.77,20.54 ; v1(15.49,27.65) 15.37,27.65 13.21,25.49 v1(3.81,25.49) 3.81,21.43 4.95,20.28 ; 48.77,20.54 64.9,20.54 65.91,21.55 v1(65.91,23.84) ; 4.95,20.28 4.95,2 5.97,0.98 9.4,0.98 11.18,2.76 ; v1(38.99,33.11) v1(38.99,40.48)
+5V: length 88.9
  Top Layer w0.6: 1.65,17.49 1.65,2.12 3.05,0.72 58.17,0.72 59.44,2 H2.1 ; R71.2 5.59,17.78 D1.1 1.49,17.87 C54.2
GND: length 31.6
  Top Layer w0.254: U49.4 49.4,17.23 v1(49.53,17.11) ; 44.83,17.87 45.07,17.64 U49.8 45.68,18.03 45.08,18.63 42.93,18.63 ; U48.4 v1(37.08,17.38) ; 32.64,18.25 33.11,17.78 33.66,17.78 33.66,18.88 v1(33.53,19.01) ; U5.11 29.33,41.25 U5.7 ; U5.11 29.21,42.13 29.21,44.41 ; U5.11 28.33,41.25 U5.4 ; 48.89,34.25 52.32,34.25 52.45,34.13 ; 48.89,34.25 48.89,35.58 ; 48.89,34.25 45.85,34.25 ; 48.89,34.25 48.89,32.78 ; v1(8.51,23.71) 7.76,22.96 U4.11 4.97,22.96 4.19,22.19
  vias: v1(3.73,41.69) v1(3.73,31.53) v1(8.81,46.78) v1(13.89,46.78) v1(13.89,36.61) v1(13.89,31.53) v1(18.97,46.78) v1(24.05,46.78) v1(24.05,26.45) v1(24.92,14.54) v1(29.13,46.78) v1(29.13,26.45) v1(32.13,14.57) v1(34.21,41.69) v1(34.21,36.61) v1(34.21,31.53) v1(34.21,26.45) v1(39.29,41.69) v1(39.29,26.45) v1(42.04,18.38) v1(44.37,36.61) v1(44.37,26.45) v1(44.58,15.97) v1(44.7,14.31) v1(49.45,46.78) v1(49.45,41.69) v1(49.45,26.45) v1(54.53,46.78) v1(54.53,41.69) v1(54.53,36.61) v1(54.53,26.45) v1(59.61,46.78) v1(64.44,35.98) v1(64.69,31.53) v1(64.69,26.45)
VBUS: length 46.3
  Top Layer w0.5: 8.34,39.33 10.92,39.33 11.43,39.84 U1.8 ; R3.2 R1.2 8.26,39.42 ; 8.31,39.05 8.26,39.1
  Top Layer w0.6: USB2.2 10.75,34.68 D8.2 ; Q2.1 16.5,38.44 16.88,38.81 U1.8 ; D8.2 10.84,30.49 10.23,29.88 USB2.11 ; D8.2 10.84,37 10.29,37.56 8.89,37.56 8.26,38.19 8.26,39.1 ; U1.4 22.73,43.69 v1(22.73,44.79)
  Bottom Layer w0.6: v1(22.73,44.79) 17.4,44.79 16.51,43.91 v1(16.51,38.44)
+BATT: length 143.5
  Top Layer w0.254: U5.2 26.46,42.25
  Top Layer w0.5: C20.2 44.55,7.53 44.55,6.28 45.16,5.67 J3.1 ; J6.2 4.72,44.05 5.46,44.79 14.35,44.79 15.49,43.65 U1.5 ; v1(25.53,42.25) 25.54,42.25 26.46,42.25 ; J8.1 52.81,5.77 D2.1 52.14,6.44 52.14,7.49 53.23,8.59 C19.2 ; C34.2 37.02,7.57 D7.1 37.63,5.84 J7.1 ; J5.1 29.99,5.28 29,6.26 30.29,7.55 C18.2
  Top Layer w0.6: 37.52,1.74 37.52,3.04 J7.1 ; 37.52,1.74 31.33,1.74 J5.1 ; 37.52,1.74 45.11,1.74 ; C18.2 26.72,8.42 v1(26.67,8.47) ; 18.8,35.78 Q2.3 ; 18.8,35.78 v1(18.8,37.05) ; 18.8,35.78 18.8,34.63 19.4,34.03 R27.2 21.62,32.37 19.7,32.37 18.78,31.44 18.78,24.24 19.63,23.39 D9.2 25.09,23.39 26.04,22.44 v1(26.04,16.09) ; J3.1 45.11,3.14 45.11,1.74 ; J8.1 51.35,1.74 45.11,1.74
  Bottom Layer w0.6: v1(26.67,8.47) 26.04,9.11 26.04,14.21 26.06,14.23 26.06,14.86 26.04,14.88 v1(26.04,16.09) ; 18.67,36.92 23.75,36.92 25.53,38.7 v1(25.53,42.25) ; 18.67,36.92 16.13,36.92 15.24,37.81 15.24,42.38 13.57,44.05 J6.2 ; 18.67,36.92 v1(18.8,37.05)
ADC_BAT: length 22.9
  Top Layer w0.254: R25.1 28.99,30.86 32.37,34.24 U8.7
  Top Layer w0.6: R26.2 R25.1
D+: length 34
  Top Layer w0.254: U9.1 v1(30.73,31.08) ; v1(9.78,31.53) USB2.8 6.03,31.53 5.84,31.71 5.84,32.22 6.15,32.53 USB2.6
  Bottom Layer w0.254: v1(9.78,31.53) 9.78,31.71 9.02,32.47 9.02,33.36 9.4,33.75 20.06,33.75 23.64,30.16 29.84,30.16 30.73,31.05 v1(30.73,31.08)
D-: length 28.7
  Top Layer w0.254: v1(9.91,33.03) 9.02,33.03 ; 9.02,33.03 USB2.5 ; 9.02,33.03 9.02,32.22 8.82,32.03 USB2.7 ; v1(30.86,29.81) U9.2
  Bottom Layer w0.254: v1(30.86,29.81) 23.49,29.81 20.28,33.03 v1(9.91,33.03)
IO0: length 37.7
  Top Layer w0.254: U10.2 63.88,31.84 R29.1 ; U8.25 61.15,25.35 61.52,24.98 61.52,19.83 v1(61.09,19.39)
  Bottom Layer w0.254: v1(61.09,19.39) 65.02,19.39 67.87,22.24 67.87,31.92 U10.2
LDO_EN: length 13
  Top Layer w0.254: U5.3 26.54,41.75 26.42,41.62 26.42,39.71 27.43,38.7 28.07,38.7 29.78,36.98 29.78,34.95 U6.2
MOT1_ESC: length 34.3
  Top Layer w0.2: 8.51,3.01 9.91,4.41 9.91,7.08 11.68,8.85 22.86,8.85 27.56,13.55 33.15,13.55 34.26,14.66 34.26,16.83
MOT1_PWM: length 2.9
  Top Layer w0.2: U48.3 36.45,16.98 36.96,16.47 R72.1
MOT2_ESC: length 35.1
  Top Layer w0.2: H6.1 11.22,9.16 22.73,9.16 27.43,13.85 29.26,13.85 30.1,14.69 30.1,19.01 30.86,19.78 33.78,19.78 34.26,19.3 U48.7
MOT2_PWM: length 2.9
  Top Layer w0.2: R73.1 36.83,18.12 36.48,17.78 U48.5
MOT3_ESC: length 37.2
  Top Layer w0.2: 18.16,3.01 19.43,4.28 19.43,7.71 19.97,8.25 23.11,8.25 27.81,12.95 40.64,12.95 41.06,13.37 45.41,13.37 46.28,14.24 U49.1
MOT3_PWM: length 3.6
  Top Layer w0.2: U49.3 48.79,16.83 49.28,16.35 R74.1
MOT4_ESC: length 37.9
  Top Layer w0.2: 18.16,6.57 18.16,8.04 18.67,8.55 22.98,8.55 27.68,13.25 40.21,13.25 40.77,13.81 40.77,18.38 41.53,19.14 45.85,19.14 46.28,18.7 U49.7
MOT4_PWM: length 3.5
  Top Layer w0.2: U49.5 49.04,17.64 49.4,18 R75.1
MOT_1: length 22.1
  Top Layer w0.2: 34.66,16.78 34.66,14.71 35.31,14.06 v1(39.12,14.06)
  Top Layer w0.254: v1(40.77,12.28) 41.52,13.04 50.06,13.04 R18.2 52.87,12.21 T1.1
  Bottom Layer w0.254: v1(39.12,14.06) 39.12,13.93 v1(40.77,12.28)
MOT_2: length 16.4
  Top Layer w0.2: 34.66,17.98 34.66,18.49 v1(35.31,19.14)
  Top Layer w0.254: T2.1 43.17,12.06 R19.2 v1(41.91,12.11)
  Bottom Layer w0.254: v1(35.31,19.14) 38.99,19.14 41.91,16.22 v1(41.91,12.11)
MOT_3: length 17.3
  Top Layer w0.254: 37.34,12.06 37.17,11.89 R30.2 ; 37.34,12.06 v1(37.34,11.39) ; 37.34,12.06 T5.1 ; U49.2 46.68,14.37 v1(46.99,14.06)
  Bottom Layer w0.254: v1(37.34,11.39) 46.1,11.39 46.99,12.28 v1(46.99,14.06)
MOT_4: length 30
  Top Layer w0.2: v1(30.23,11.14) 30.24,11.15 T4.1 ; U49.6 46.68,18.7 v1(46.86,18.89)
  Top Layer w0.254: R21.2 30.18,12.1 T4.1
  Bottom Layer w0.2: v1(30.23,11.14) 30.23,14.54 32.39,16.7 32.39,20.28 33.53,21.43 38.73,21.43 40.08,20.08 45.66,20.08 v1(46.86,18.89)
MOTOR_MODE: length 35.6
  Top Layer w0.2: U49.10 45.68,15.29 45.47,15.08 43.36,15.08 R76.2 ; v1(33.53,20.54) 33.91,20.92 44.96,20.92 45.97,21.93 U8.16 ; 33.66,16.98 33.14,16.98 32.89,16.73 v1(32.89,16.35)
  Top Layer w0.254: R76.2 41.27,15.13
  Bottom Layer w0.2: v1(32.89,16.35) 32.89,19.9 v1(33.53,20.54)
  Bottom Layer w0.254: v1(32.89,16.35) 34.11,15.13 v1(41.32,15.13)
RX: length 46.1
  Top Layer w0.254: v1(56.01,29.92) 56.13,30.05 56.13,36.16 56.75,36.78 U8.34 61.58,36.78 62.71,37.91 62.71,44.26 63.25,44.79 H1.2 ; v1(35.81,28.54) U9.6
  Bottom Layer w0.254: v1(35.81,28.54) 36.7,29.43 55.51,29.43 v1(56.01,29.92)
RX2: length 16.5
  Top Layer w0.254: H2.3 60.83,16.22 60.83,17.74 57.63,20.94 57.63,27.5 58.02,27.89 U8.27
SCL: length 92.5
  Top Layer w0.254: 13.07,24.46 13.71,24.46 R16.1 ; 13.07,24.46 U4.23 ; 13.07,24.46 13.08,24.46 v1(13.08,23.97) ; U8.36 v1(57.15,39.32)
  Bottom Layer w0.254: v1(13.08,23.97) 14.86,23.97 16.51,25.62 16.51,28.28 17.37,29.15 32.75,29.15 35.16,31.56 54.08,31.56 56.39,33.87 56.39,38.56 v1(57.15,39.32) 59.04,37.43 66.67,37.43 68.58,35.52 68.58,19.78 67.82,19.01 67.82,17.62 H4.4
SCL0: length 15.8
  Top Layer w0.254: U8.29 61.36,30.43 62.23,29.55 62.23,18.89 H3.4
SDA: length 89.8
  Top Layer w0.254: U4.24 12.56,24.96 R15.1 13.97,26.39 13.97,28.16 14.48,28.67 16.64,28.67 v1(17.27,28.03) ; U8.33 v1(57.15,35.51)
  Bottom Layer w0.254: v1(17.27,28.03) 18.03,28.79 32.89,28.79 35.31,31.2 54.22,31.2 57.15,34.13 v1(57.15,35.51) 58.71,37.07 66.53,37.07 68.22,35.38 68.22,20.31 66.55,18.63 66.55,16.35 H4.3
SDA0: length 14.4
  Top Layer w0.254: U8.26 61.1,26.62 61.87,25.85 61.87,16.7 H3.3
SRV_2: length 72.2
  Top Layer w0.254: U8.31 59.56,33.11 v1(61.59,33.11) ; U4.12 5.61,22.46 v1(5.21,22.06)
  Bottom Layer w0.254: v1(61.59,33.11) 61.59,22.19 60.45,21.05 41.27,21.05 39.88,22.44 5.59,22.44 v1(5.21,22.06)
TX: length 47.3
  Top Layer w0.254: v1(55.37,30.7) 55.75,31.08 55.75,37.43 56.37,38.05 U8.35 61.33,38.05 62.36,39.08 62.36,46.44 63.25,47.33 H1.1 ; U9.7 v1(35.81,29.81)
  Bottom Layer w0.254: 43.84,29.81 44.25,30.21 54.89,30.21 v1(55.37,30.7) ; 43.84,29.81 43.82,29.78 ; 43.84,29.81 v1(35.81,29.81)
TX2: length 14.5
  Top Layer w0.254: 59.44,17.36 57.28,19.52 57.28,28.67 57.77,29.16 U8.28
$1N491: length 6.8
  Top Layer w0.254: R2.2 24.51,38.06 24.77,38.32 24.77,40.6 24.26,41.11 U1.2
$1N492: length 3.7
  Top Layer w0.254: U1.7 13.18,41.11 LED1.1
$1N493: length 3.9
  Top Layer w0.254: U1.6 13.65,42.38 LED2.1
$1N494: length 1.8
  Top Layer w0.254: R3.1 11.44,42.98 LED2.2
$1N495: length 1.9
  Top Layer w0.254: LED1.2 11.43,40.95 R1.1
$1N870: length 2.2
  Top Layer w0.254: C28.2 32.05,40.75 U5.6
$1N872: length 5.8
  Top Layer w0.254: U5.8 33.15,41.75 33.53,42.13 R23.1
$1N1145: length 4.3
  Top Layer w0.6: 16.44,34.76 16.51,34.69 C24.2 ; 16.44,34.76 Q2.2 ; 16.44,34.76 D8.1
$1N1344: length 6.3
  Top Layer w0.254: R27.1 25.57,35.54 U6.3
$1N5121: length 3.7
  Top Layer w0.254: C15.1 14.15,22.96 U4.20
$1N5126: length 3.7
  Top Layer w0.254: R17.2 3.41,23.96 U4.9
$1N5127: length 4.3
  Top Layer w0.254: U4.10 4.51,23.46 C17.2
$1N5140: length 9
  Top Layer w0.5: J8.2 55.67,4.07 D2.2 55.67,7.67 C19.1 54.63,11.03 T1.3
$1N5142: length 8.8
  Top Layer w0.5: J3.2 48.02,4.05 D3.2 48.02,7.28 46.86,8.44 46.86,11.06 T2.3
$1N5148: length 8.8
  Top Layer w0.5: T4.3 32.24,8.98 C18.1 32.47,7.64 D5.2 32.47,3.57 J5.2
$1N7597: length 5.6
  Top Layer w0.254: U8.3 38.08,39.32 R28.1 C33.2
$1N14604: length 8.9
  Top Layer w0.5: J7.2 40.49,4.01 D7.2 40.49,7.32 C34.1 39.33,11.1 T5.3
$1N20359: length 4.4
  Top Layer w0.254: R71.1 5.72,13.55 8.38,13.55 8.57,13.36 U47.3
$1N20367: length 1.7
  Top Layer w0.254: R43.2 12.2,13.36 U47.4
$1N24117: length 25.9
  Top Layer w0.254: v1(48.77,21.68) 46.99,19.9 41.78,19.9 40.44,18.56 40.44,17.42 R72.2 ; v1(47.75,26.25) 47.75,27.52 44.85,30.43 U8.10
  Bottom Layer w0.254: v1(48.77,21.68) 48.77,25.24 v1(47.75,26.25)
$1N24167: length 21.3
  Top Layer w0.254: v1(46.61,26.38) 46.61,27.39 44.85,29.16 U8.11 ; R73.2 41.95,20.59 46.28,20.59 v1(47.37,21.68)
  Bottom Layer w0.254: v1(46.61,26.38) 47.37,25.62 v1(47.37,21.68)
$1N24195: length 22.4
  Top Layer w0.254: R74.2 53.21,17.37 v1(53.21,21.81) ; v1(43.31,27.78) 41.53,27.78 U8.12
  Bottom Layer w0.254: v1(43.31,27.78) 50.92,27.78 53.21,25.49 v1(53.21,21.81)
$1N24223: length 19.6
  Top Layer w0.254: U8.13 41.56,26.76 v1(43.31,26.76) ; R75.2 v1(52.19,21.81)
  Bottom Layer w0.254: v1(52.19,21.81) 52.19,26.01 50.93,27.27 43.82,27.27 v1(43.31,26.76)

## Copper pours and planes (outline as drawn; the poured copper is in the pictures)
+3.3V on Top Layer: 29.97,47.51 39.62,47.51 39.62,42.16 29.97,42.16
GND on Top Layer: -2.92,51.78 73.66,51.78 73.66,-4.23 -2.92,-4.23
GND on Bottom Layer: -3.43,54.32 74.68,54.32 74.68,-2.96 -3.43,-2.96
$1N867 on Top Layer: 26.54,47.59 27.73,47.59 27.73,42.75 26.54,42.75
$1N20363 on Top Layer: 8.84,21.96 18.69,21.96 18.69,15.08 8.84,15.08
$1N20365 on Top Layer: 11.57,19.9 23.37,19.9 23.37,10.99 11.57,10.99

Small or netless copper shapes (teardrops, artwork), in the pictures only: 142 on Top Layer, 23 on Bottom Layer

## Text on the board
Top Silkscreen Layer: -电池+ | TX RX G | +电机- | 雷达 | TOF
